# Altium schematic sheet Tracking-Car.SchDoc
size 281 x 228 mm; SheetNumber: 1; SheetTotal: 1
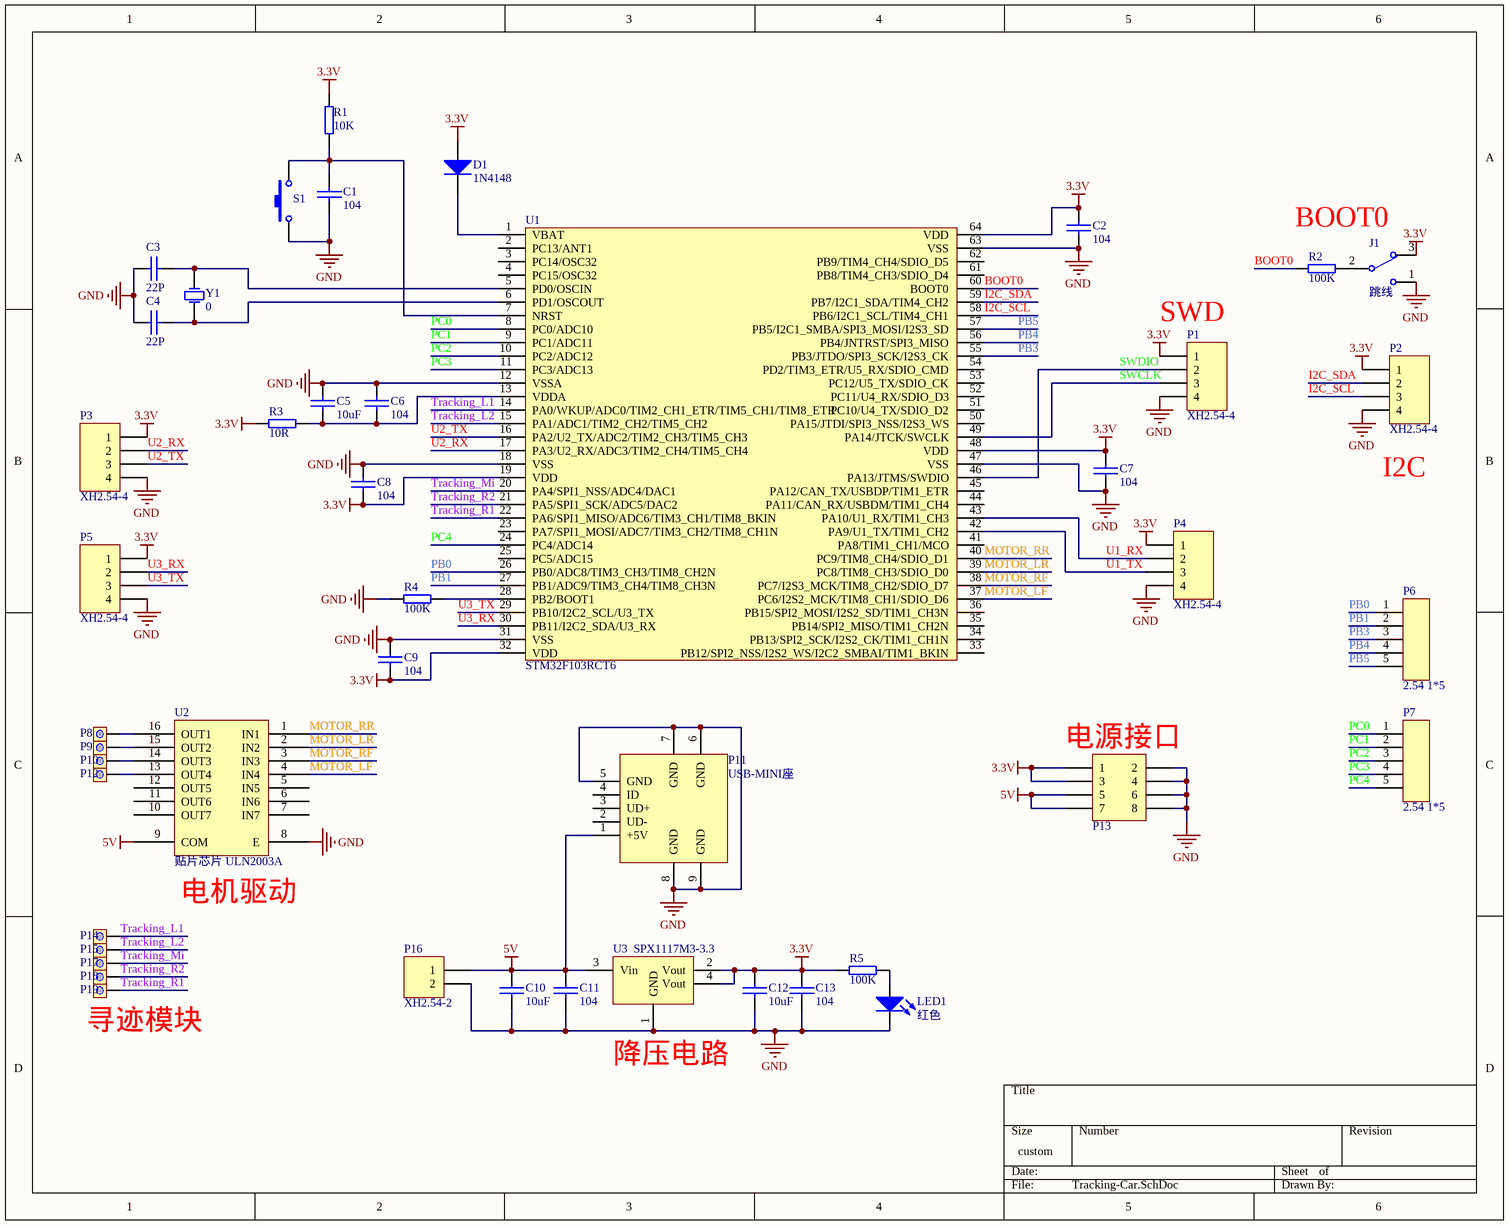
[diagram p0: Tracking-Car.SchDoc]

## Parts
C1  104  [0805]
C2  104  [0805]
C3  22P  [0805]
C4  22P  [0805]
C5  10uF  [0805]
C6  104  [0805]
C7  104  [0805]
C8  104  [0805]
C9  104  [0805]
C10  10uF  [0805]
C11  104  [0805]
C12  10uF  [0805]
C13  104  [0805]
D1  1N4148  [二极管 贴片 IN4148]
J1  跳线  [单排插针 2.54 1*3]
LED1  红色  [LED0805]
P1  XH2.54-4  [VH2.54_4]
P2  XH2.54-4  [VH2.54_4]
P3  XH2.54-4  [VH2.54_4]
P4  XH2.54-4  [VH2.54_4]
P5  XH2.54-4  [VH2.54_4]
P6  2.54 1*5  [单排插针 2.54 1*5]
P7  2.54 1*5  [单排插针 2.54 1*5]
P8  TEST  [焊盘]  (value not drawn)
P9  TEST  [焊盘]  (value not drawn)
P10  TEST  [焊盘]  (value not drawn)
P11  USB-MINI座  [USB MINI DIP]
P12  TEST  [焊盘]  (value not drawn)
P13  双排插针 2.54 2*4  [双排插针 2.54 2*4]  (value not drawn)
P14  TEST  [焊盘]  (value not drawn)
P15  TEST  [焊盘]  (value not drawn)
P16  XH2.54-2  [VH2.54_2]
P17  TEST  [焊盘]  (value not drawn)
P18  TEST  [焊盘]  (value not drawn)
P19  TEST  [焊盘]  (value not drawn)
R1  10K  [0805]
R2  100K  [0805]
R3  10R  [0805]
R4  100K  [0805]
R5  100K  [0805]
S1  key  [按键 轻触  6*3]  (value not drawn)
U1  STM32F103RCT6  [LQFP64]
U2  贴片芯片 ULN2003A  [SOIC16]
U3  SPX1117M3-3.3  [SOT223]
Y1  0  [晶振 BCY-W2/E4.7]

## Nets
3.3V: C2.2 C7.1 C8.1 C9.1 C12.2 C13.2 D1.1(A) J1.3 P1.1 P2.1 P3.1 P4.1 P5.1 P13.1 P13.3 R1.1 R3.2 R5.2 U1.19(VDD) U1.32(VDD) U1.48(VDD) U1.64(VDD) U3.2(Vout) U3.4(Vout)
5V: C10.2 C11.2 P11.1(+5V) P13.5 P13.7 P16.1 U2.9(COM) U3.3(Vin)
GND: C1.1 C2.1 C3.1 C4.1 C5.2 C6.2 C7.2 C8.2 C9.2 C10.1 C11.1 C12.1 C13.1 J1.1 LED1.2(K) P1.4 P2.4 P3.4 P4.4 P5.4 P11.5(GND) P11.6(GND) P11.7(GND) P11.8(GND) P11.9(GND) P13.2 P13.4 P13.6 P13.8 P16.2 R4.2 S1.1 U1.12(VSSA) U1.18(VSS) U1.31(VSS) U1.47(VSS) U1.63(VSS) U2.8(E) U3.1(GND)
BOOT0: R2.2 U1.60(BOOT0)
I2C_SCL: P2.3 U1.58(PB6/I2C1_SCL/TIM4_CH1)
I2C_SDA: P2.2 U1.59(PB7/I2C1_SDA/TIM4_CH2)
MOTOR_LF: U1.37(PC6/I2S2_MCK/TIM8_CH1/SDIO_D6) U2.4(IN4)
MOTOR_LR: U1.39(PC8/TIM8_CH3/SDIO_D0) U2.2(IN2)
MOTOR_RF: U1.38(PC7/I2S3_MCK/TIM8_CH2/SDIO_D7) U2.3(IN3)
MOTOR_RR: U1.40(PC9/TIM8_CH4/SDIO_D1) U2.1(IN1)
PB0: P6.1 U1.26(PB0/ADC8/TIM3_CH3/TIM8_CH2N)
PB1: P6.2 U1.27(PB1/ADC9/TIM3_CH4/TIM8_CH3N)
PB3: P6.3 U1.55(PB3/JTDO/SPI3_SCK/I2S3_CK)
PB4: P6.4 U1.56(PB4/JNTRST/SPI3_MISO)
PB5: P6.5 U1.57(PB5/I2C1_SMBA/SPI3_MOSI/I2S3_SD)
PC0: P7.1 U1.8(PC0/ADC10)
PC1: P7.2 U1.9(PC1/ADC11)
PC2: P7.3 U1.10(PC2/ADC12)
PC3: P7.4 U1.11(PC3/ADC13)
PC4: P7.5 U1.24(PC4/ADC14)
SWCLK: P1.3 U1.49(PA14/JTCK/SWCLK)
SWDIO: P1.2 U1.46(PA13/JTMS/SWDIO)
Tracking_L1: P14.1 U1.14(PA0/WKUP/ADC0/TIM2_CH1_ETR/TIM5_CH1/TIM8_ETR)
Tracking_L2: P15.1 U1.15(PA1/ADC1/TIM2_CH2/TIM5_CH2)
Tracking_Mi: P17.1 U1.20(PA4/SPI1_NSS/ADC4/DAC1)
Tracking_R1: P19.1 U1.22(PA6/SPI1_MISO/ADC6/TIM3_CH1/TIM8_BKIN)
Tracking_R2: P18.1 U1.21(PA5/SPI1_SCK/ADC5/DAC2)
U1_RX: P4.2 U1.43(PA10/U1_RX/TIM1_CH3)
U1_TX: P4.3 U1.42(PA9/U1_TX/TIM1_CH2)
U2_RX: P3.2 U1.17(PA3/U2_RX/ADC3/TIM2_CH4/TIM5_CH4)
U2_TX: P3.3 U1.16(PA2/U2_TX/ADC2/TIM2_CH3/TIM5_CH3)
U3_RX: P5.2 U1.30(PB11/I2C2_SDA/U3_RX)
U3_TX: P5.3 U1.29(PB10/I2C2_SCL/U3_TX)
NetC1_2: C1.2 R1.2 S1.2 U1.7(NRST)
NetC3_2: C3.2 U1.5(PD0/OSCIN) Y1.2(OSC2)
NetC4_2: C4.2 U1.6(PD1/OSCOUT) Y1.1(OSC1)
NetC5_1: C5.1 C6.1 R3.1 U1.13(VDDA)
NetD1_2: D1.2(K) U1.1(VBAT)
NetJ1_2: J1.2 R2.1
NetLED1_1: LED1.1(A) R5.1
NetP8_1: P8.1 U2.16(OUT1)
NetP9_1: P9.1 U2.15(OUT2)
NetP10_1: P10.1 U2.14(OUT3)
NetP12_1: P12.1 U2.13(OUT4)
NetR4_1: R4.1 U1.28(PB2/BOOT1)

Not connected (* = marked no-connect by the designer): P11 2(UD-) 3(UD+) 4(ID); U1 2(PC13/ANT1) 3(PC14/OSC32) 4(PC15/OSC32) 23(PA7/SPI1_MOSI/ADC7/TIM3_CH2/TIM8_CH1N) 25(PC5/ADC15) 33(PB12/SPI2_NSS/I2S2_WS/I2C2_SMBAI/TIM1_BKIN) 34(PB13/SPI2_SCK/I2S2_CK/TIM1_CH1N) 35(PB14/SPI2_MISO/TIM1_CH2N) 36(PB15/SPI2_MOSI/I2S2_SD/TIM1_CH3N) 41(PA8/TIM1_CH1/MCO) 44(PA11/CAN_RX/USBDM/TIM1_CH4) 45(PA12/CAN_TX/USBDP/TIM1_ETR) 50(PA15/JTDI/SPI3_NSS/I2S3_WS) 51(PC10/U4_TX/SDIO_D2) 52(PC11/U4_RX/SDIO_D3) 53(PC12/U5_TX/SDIO_CK) 54(PD2/TIM3_ETR/U5_RX/SDIO_CMD) 61(PB8/TIM4_CH3/SDIO_D4) 62(PB9/TIM4_CH4/SDIO_D5); U2 5(IN5) 6(IN6) 7(IN7) 10(OUT7) 11(OUT6) 12(OUT5)

## Notes on the sheet
- BOOT0
- (near P1) SWD
- (near P2) I2C
- (near P13) 电源接口
- (near U2) 电机驱动
- (near P19) 寻迹模块
- (near U3) 降压电路

## Library data of the parts
C1-C13 = 电容 贴片 0805: 名称: 贴片电容; 单位: 个; 封装: 0805
D1 = 二极管 贴片 1N4148: 名称: 贴片二极管; 封装: 贴片; 单位: 个
J1 = 联结件 跳线端子 2.54-3: 单位: 个; 封装: 直插; 名称: 跳线插针
LED1 = 二极管 贴片发光 0805: 名称: 贴片发光二极管; 封装: 0805; 单位: 个
P1-P5 = 联结件 XH2.54-4: 名称: 联结件; 单位: 套; 封装: XH2.54-4
P6 P7 = 联结件 单排插针 2.54 1*5: 单位: 片; 封装: DIP; 名称: 单排插针
P8-P10 P12 P14 P15 P17-P19 = 焊盘: 单位: 个; 封装: 直插; 名称: 焊盘
P11 = 联结件 USB-MINI座: 单位: 个; 封装: 440068; 名称: 联结件
P13 = 联结件 双排插针 2.54 2*4: 名称: 联结件; 单位: 个; 封装: 直插
P16 = 联结件 XH2.54-2: 名称: 联结件; 封装: VH3.96-2; 单位: 套
R1-R5 = 电阻 贴片 0805: 名称: 贴片电阻; 单位: 个; 封装: 0805
S1 = 按键 轻触 3*6: 单位: 个; 名称: 开关; 封装: 直插 12*12*12
U1 = 贴片芯片 STM32F103RCT6: 单片机; 名称: 芯片; 单位: 片; 封装: LQFP64
U2 = 贴片芯片 ULN2003A: 单位: 片; 封装: SOIC16; 名称: 贴片芯片
U3 = 贴片芯片 SPX1117M3-3.3: LDO; 名称: 贴片芯片; 单位: 个; 封装: SOT223
Y1 = 晶振 直插矮: 名称: 晶振; 封装: 直插矮; 单位: 个